# Altium project sonata-board.PrjPcb (part 1 of 4)
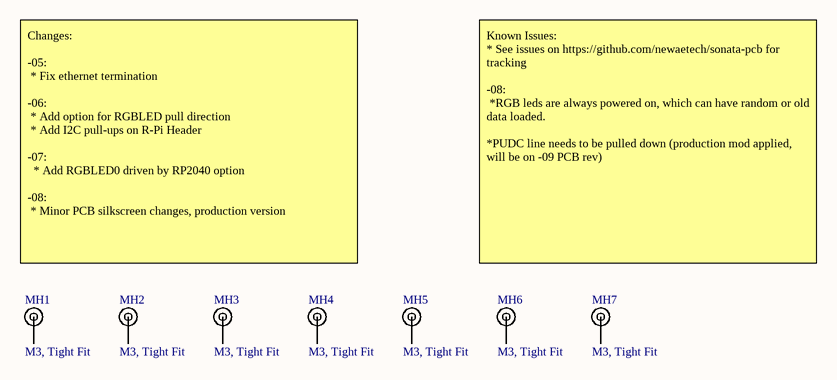
[diagram p0: sb-sonata-mech.SchDoc]
PrjRev: 09; PrjName: Sonata; PrjLicense: CC-SA
20 sheets, 468 parts. Net scope: global (net labels, ports and power ports of the same name join across sheets).
Board file: cheriot-test.PcbDoc
Sheets:
  sb-sonata-mech.SchDoc
  sb-sonata-usb.SchDoc
  sb-sonata-usbhub.SchDoc
  sb-sonata-headers1.SchDoc
  sb-sonata-usbrp.SchDoc
  sb-sonata-industriaal.SchDoc
  sb-sonata-debug.SchDoc
  sb-sonata-led.SchDoc
  sb-sonata-microsd.SchDoc
  sb-sonata-ethmac.SchDoc
  sb-sonata-fpga.SchDoc
  sb-sonata-fpgaio1.SchDoc
  sb-sonata-fpgaio2.SchDoc
  sb-sonata-fpgapwr.SchDoc
  sb-sonata-fpganaalog.SchDoc
  sb-sonata-analoginput.SchDoc
  sb-sonata-psu.SchDoc
  sb-sonata-usbphy.SchDoc
  sb-sonata-hyperram.SchDoc
  sb-sonata-lcd.SchDoc

## Sheet sb-sonata-mech.SchDoc: Mechanical & Title Page
size Letter; Organization: NewAE Technology Inc.; Address1: 1083 Queen St., Suite 196; Address2: Halifax; Address3: NS; Address4: Canada B3H 0B2; SheetNumber: 1; SheetTotal: 20; SheetApproved: YES

### Parts
MH1  M3, Tight Fit  [MOUNT_M3_TIGHT]
MH2  M3, Tight Fit  [MOUNT_M3_TIGHT]
MH3  M3, Tight Fit  [MOUNT_M3_TIGHT]
MH4  M3, Tight Fit  [MOUNT_M3_TIGHT]
MH5  M3, Tight Fit  [MOUNT_M3_TIGHT]
MH6  M3, Tight Fit  [MOUNT_M3_TIGHT]
MH7  M3, Tight Fit  [MOUNT_M3_TIGHT]

### Nets

Not connected (* = marked no-connect by the designer): MH1 1; MH2 1; MH3 1; MH4 1; MH5 1; MH6 1; MH7 1

### Notes on the sheet
- Changes:
  -05:
  * Fix ethernet termination
  -06:
  * Add option for RGBLED pull direction
  * Add I2C pull-ups on R-Pi Header
  -07:
  * Add RGBLED0 driven by RP2040 option
  -08:
  * Minor PCB silkscreen changes, production version
- Known Issues:
  * See issues on https://github.com/newaetech/sonata-pcb for tracking
  -08:
  *RGB leds are always powered on, which can have random or old data loaded.
  *PUDC line needs to be pulled down (production mod applied, will be on -09 PCB rev)
- Title:
- Date:
- Rev:
- Time:
- Project:
- Sheet
- of
- License:
- Copyright © NewAE Technology Inc.
- Approved:
- NewAE.com
- File:

### Library data of the parts
MH1-MH7 = MOUNT_M3_TIGHT: Machine screw M3 Mounting Hole; Component Group: Mechanical; PP Material Stack: 0; Part Number: MOUNT_M3_TIGHT; Pin Count: 1; Component Kind: Mechanical; Component Type: Mechanical; PP Rotation: 0

## Sheet sb-sonata-usb.SchDoc: Debug USB & Power In
size Letter; Organization: NewAE Technology Inc.; Address1: 1083 Queen St., Suite 196; Address2: Halifax; Address3: NS; Address4: Canada B3H 0B2; SheetNumber: 2; SheetTotal: 20; SheetApproved: YES
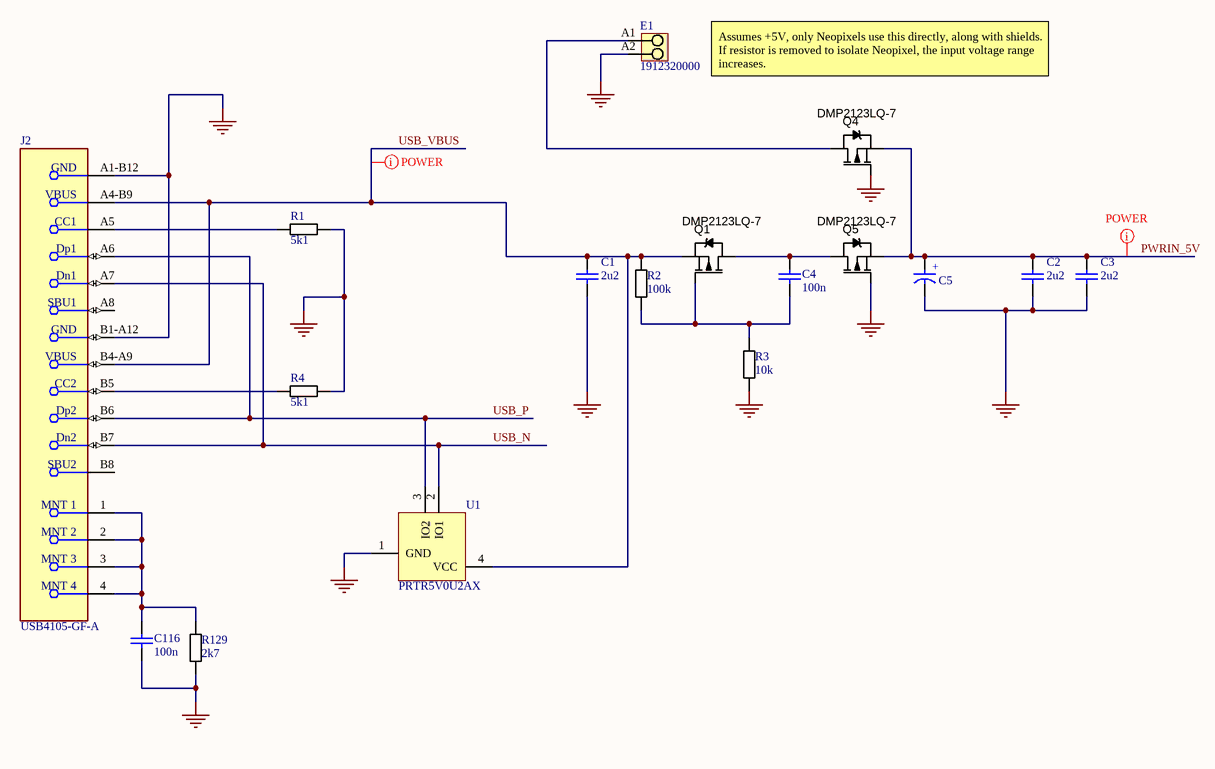
[diagram p1: sb-sonata-usb.SchDoc]

### Parts
C1  2u2  [CAPC0603_M]
C2  2u2  [CAPC0603_M]
C3  2u2  [CAPC0603_M]
C4  100n  [CAPC0402_M]
C5  680uF  [Cap_16v_680uF]  (value not drawn)
C116  100n  [CAPC0402_M]
E1  1912320000  [PS_3_5_90_02]
J2  USB4105-GF-A  [FP-USB4105-GF-A-MFG]
Q1  DMP2123LQ-7  [SOT95P245X110-3M]
Q4  DMP2123LQ-7  [SOT95P245X110-3M]
Q5  DMP2123LQ-7  [SOT95P245X110-3M]
R1  5k1  [RESC1608X55N]
R2  100k  [RESC1005X40N]
R3  10k  [RESC1005X40N]
R4  5k1  [RESC1608X55N]
R129  2k7  [RESC1005X40N]
U1  PRTR5V0U2AX  [SOT143B]

### Nets
GND: C1.2 C2.2 C3.2 C5.2 C116.2 E1.A2 J2.A1-B12(GND) J2.B1-A12(GND) Q4.1(G) Q5.1(G) R1.2 R3.2 R4.2 R129.2 U1.1(GND)
PWRIN_5V: C2.1 C3.1 C5.1 Q4.2(S) Q5.2(S)
USB_N: J2.A7(Dn1) J2.B7(Dn2) U1.2(IO1)
USB_P: J2.A6(Dp1) J2.B6(Dp2) U1.3(IO2)
USB_VBUS: C1.1 J2.A4-B9(VBUS) J2.B4-A9(VBUS) Q1.2(S) R2.1 U1.4(VCC)
NetC4_1: C4.1 Q1.3(D) Q5.3(D)
NetC4_2: C4.2 Q1.1(G) R2.2 R3.1
NetC116_1: C116.1 J2.1(MNT_1) J2.2(MNT_2) J2.3(MNT_3) J2.4(MNT_4) R129.1
NetE1_A1: E1.A1 Q4.3(D)
NetJ2_A5: J2.A5(CC1) R1.1
NetJ2_B5: J2.B5(CC2) R4.1

Not connected (* = marked no-connect by the designer): J2 A8(SBU1) B8(SBU2)

### Layout directives
net class Power: PWRIN_5V, USB_VBUS

### Notes on the sheet
- Assumes +5V, only Neopixels use this directly, along with shields. If resistor is removed to isolate Neopixel, the input voltage range increases.
- Title:
- Date:
- Rev:
- Time:
- Project:
- Sheet
- of
- License:
- Copyright © NewAE Technology Inc.
- Approved:
- NewAE.com
- File:
- (in symbol Cap_16v_680uF) +

### Library data of the parts
C1-C3 = CCHIP-2u2-0603: 2u2, 0603; Manufacture 1: Samsung; Manufacture Part Number 1: CL10B225KP8NNNC; Component Group: Capacitor; Case-EIA: 0603; Case-Metric: 1608; Rated Voltage: 10VDC; Part Number: CCHIP-2u2-0603; Footprint: 0603; Pin Count: 2; Supplier 1: Digi-Key; Supplier Part Number 1: 1276-1134-2-ND; Value: 2u2; Mounting Technology: SMT; Component Kind: Standard; Component Type: Standard
C4 C116 = CCHIP-100n-0402: 100n, 0402; Manufacture Part Number 1: CGA2B3X7R1V104K050BB; Component Group: Capacitor; Case-EIA: 0402; Part Number: CCHIP-100n-0402; Footprint: 0402; Pin Count: 2; Supplier 1: Digi-Key; Supplier Part Number 1: 445-6901-1-ND; Value: 100n; Mounting Technology: SMT; Component Kind: Standard; Component Type: Standard
C5 = Cap_16v_680uF: Aluminum electrolytic 680uF, 8x16mm, radial; Component Group: Capacitor; PP Material Stack: 0; Part Number: Cap_16v_680uF; Pin Count: 2; Value: 680uF; Mounting Technology: Through-hole; Component Kind: Standard; Component Type: Standard; PP Rotation: 0
E1 = CMP-1559-01633-1: OMNIMATE Signal - series PS; Manufacturer: Weidmueller; Mounting_onto_the_PCB: Solder connection; Rated_voltage_for_surge_voltage_class_pollution_degree_II_2: 320 V; UL_94_flammability_rating: V-0; Wire_cross_section_AWG_max_UL_1059: AWG 16; Solid_max_H05_07_V_U: 1,5 mm²; Contact_surface: tinned; Solder_pin_length_mm: 3,5 mm; Solid_min_H05_07_V_U: 0,2 mm²; Side_termination_characteristic: closed side; Rated_current_use_group_B_UL_1059: 10 A; Short_text_for_material: PS 3.50/02/90 3.5SN OR BX; Rated_voltage_use_group_B_UL_1059: 300 V; Pitch_inch: 0,138 inch; Wire_cross_section_AWG_min_UL_1059: AWG 28; Contact_material: Cu-Leg; No_of_poles: 2; Insulating_material: Wemid (PA); Colour: Orange; ComponentLink2Description: URL Link1; PackageReference: PS_3_5_90_02; ComponentLink1URL: http://www.weidmueller.com/; PartNumber: 1912320000; ComponentLink2URL: http://catalog.weidmueller.com/catalog/Start.do?localeId=en&ObjectID=1912320000; Revision: V1; Pitch_mm: 3,5 mm; Qty: 100 PCS; ComponentLink1Description: Manufacturer URL; Packaging: Box
J2 = CMP-245163-000001-1: CONN RCPT USB2.0 TYPEC 5A; Manufacturer: GCT; Voltage Rating: 20V; Is Female: yes; Current Rating: 5/6.25/1.25/0.25A; Number Of Contacts: 16; Conn Orientation: Right Angle; Device Class L1: Connectors; Category: Conn; Lead Free: Yes; RoHS: TRUE; Temperature Range High: +85°C; Digikey Description: CONN RCPT USB2.0 TYPEC 5A; Device Class L3: unset; ComponentLink2Description: Datasheet; Manufacturer Part Number: USB4105-GF-A; Package: 0; Usb Standard: USB 2.0; Device Class L2: USB Connectors; Automotive: No; Temperature Range Low: -40°C; Height: 3.46mm; Temperature: -40°C to +85°C; Contact Material: Gold,Nickel; ComponentLink2URL: https://gct.co/files/drawings/usb4105.pdf; Octopart: https://octopart.com/usb4105-gf-a-gct-106627878
Q1 Q4 Q5 = DMP2123LQ-7: P-Channel, 3A, Logic Level; Manufacture 1: Diodes Inc.; Component Group: MOSFET; Part Number: DMP2123LQ-7; Footprint: SOT23; Manufacture Part Number 1: DMP2123LQ-7; Pin Count: 3; Supplier 1: Digi-Key; Supplier Part Number 1: DMP2123LQ-7DICT-ND; Mounting Technology: SMT; Component Kind: Standard; Component Type: Standard
R1 R4 = RCHIP-5K1-0603: 5k1 res, 0603, 1%, 1/10W; Manufacture 1: Yageo; Manufacture Part Number 1: RC0603FR-075K1L; Component Group: Resistor; Case-EIA: 0603; Case-Metric: 1608; Rated Power: 0.1W; Rated Voltage: 75VDC; Part Number: RCHIP-5K1-0603; Footprint: 0603; Pin Count: 2; Supplier 1: Digi-Key; Supplier Part Number 1: 311-5.10KHRCT-ND; Value: 5k1; Tolerance: 1%; Mounting Technology: SMT; Temperature Range: -55C to 155C; Component Kind: Standard; Component Type: Standard
R2 = RCHIP-100K-0402: 100k res, 0402, 1%, 1/16W; Manufacture 1: Yageo; Manufacture Part Number 1: RC0402FR-07100KL; Component Group: Resistor; Case-EIA: 0402; Case-Metric: 1005; Rated Power: 0.063W; Rated Voltage: 75VDC; Part Number: RCHIP-100K-0402; Footprint: 0402; Pin Count: 2; Supplier 1: Digi-Key; Supplier Part Number 1: 311-100KLRCT-ND; Value: 100k; Tolerance: 1%; Mounting Technology: SMT; Temperature Range: -55C to 155C; Component Kind: Standard; Component Type: Standard
R3 = RCHIP-10K-0402: 10k res, 0402, 1%, 1/16W; Manufacture 1: Yageo; Manufacture Part Number 1: RC0402FR-0710KL; Component Group: Resistor; Case-EIA: 0402; Case-Metric: 1005; Rated Power: 0.063W; Rated Voltage: 75VDC; Part Number: RCHIP-10K-0402; Footprint: 0402; Pin Count: 2; Supplier 1: Digi-Key; Supplier Part Number 1: 311-10.0KLRCT-ND; Value: 10k; Tolerance: 1%; Mounting Technology: SMT; Temperature Range: -55C to 155C; Component Kind: Standard; Component Type: Standard
R129 = RCHIP-2K7-0402: 2k7 res, 0402, 1%, 1/16W; Manufacture 1: Yageo; Manufacture Part Number 1: RC0402FR-072K7L; Component Group: Resistor; Case-EIA: 0402; Case-Metric: 1005; Rated Power: 0.063W; Rated Voltage: 75VDC; Part Number: RCHIP-2K7-0402; Footprint: 0402; Pin Count: 2; Supplier 1: Digi-Key; Supplier Part Number 1: 311-2.70KLRCT-ND; Value: 2k7; Tolerance: 1%; Mounting Technology: SMT; Temperature Range: -55C to 155C; Component Kind: Standard; Component Type: Standard
U1 = PRTR5V0U2AX: USB 2.0 high-speed ESD; Component Group: Diode; Supplier 1: Digi-Key; Supplier Part Number 1: 568-7445-1-ND; Part Number: PRTR5V0U2AX; Pin Count: 4; Component Kind: Standard; Component Type: Standard

## Sheet sb-sonata-usbhub.SchDoc: USB Hub
size Letter; Organization: NewAE Technology Inc.; Address1: 1083 Queen St., Suite 196; Address2: Halifax; Address3: NS; Address4: Canada B3H 0B2; SheetNumber: 3; SheetTotal: 20; SheetApproved: YES
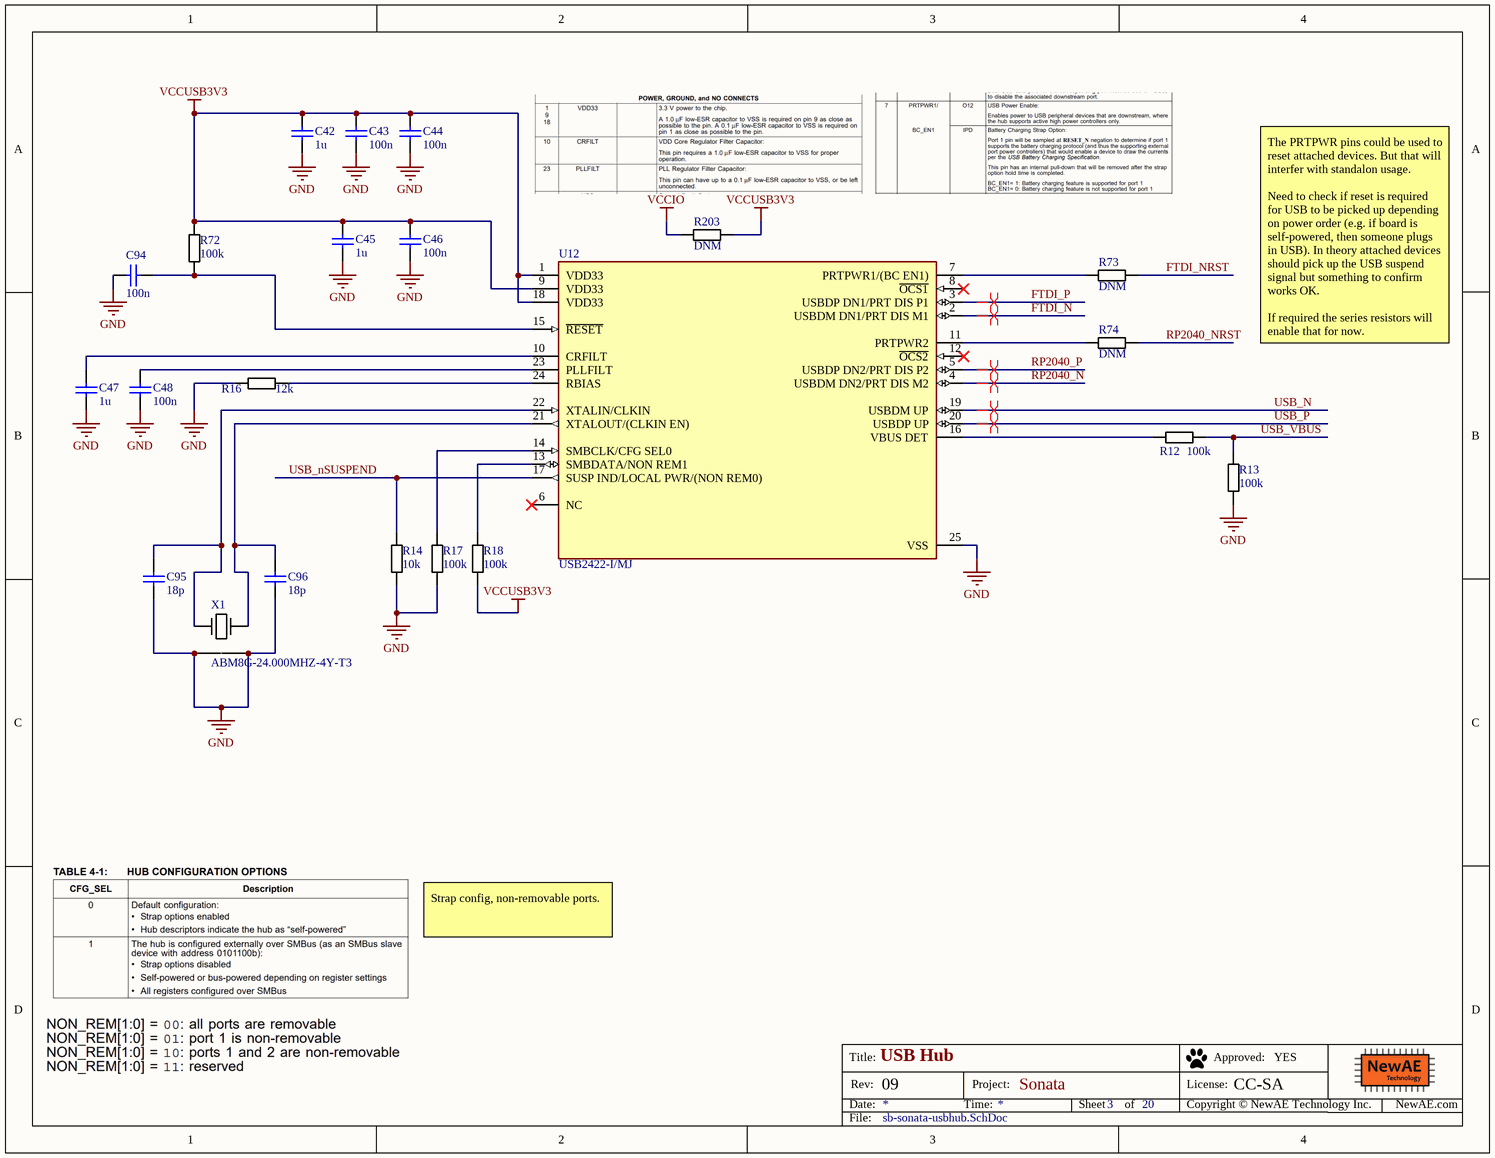
[diagram p2: sb-sonata-usbhub.SchDoc]

### Parts
C42  1u  [CAPC0603_M]
C43  100n  [CAPC0402_M]
C44  100n  [CAPC0402_M]
C45  1u  [CAPC0603_M]
C46  100n  [CAPC0402_M]
C47  1u  [CAPC0603_M]
C48  100n  [CAPC0402_M]
C94  100n  [CAPC0402_M]
C95  18p  [CAPC0402_M]
C96  18p  [CAPC0402_M]
R12  100k  [RESC1005X40N]
R13  100k  [RESC1005X40N]
R14  10k  [RESC1005X40N]
R16  12k  [RESC1005X40N]
R17  100k  [RESC1608X55N]
R18  100k  [RESC1608X55N]
R72  100k  [RESC1608X55N]
R73  DNM  [RESC1005X40N]
R74  DNM  [RESC1005X40N]
R203  DNM  [RESC1005X40N]
U12  USB2422-I/MJ  [FP-24-S4QFN-4x4B-0_5P-MFG]
X1  ABM8G-24.000MHZ-4Y-T3  [ABM8G]

### Nets
GND: C42.2 C43.2 C44.2 C45.2 C46.2 C47.2 C48.2 C94.2 C95.2 C96.2 R13.2 R14.2 R16.2 R17.1 U12.25(VSS) X1.2(GND) X1.4(GND)
VCCIO: R203.1  [project net 3V3_FTDI]
VCCUSB3V3: C42.1 C43.1 C44.1 C45.1 C46.1 R18.1 R72.2 R203.2 U12.1(VDD33) U12.9(VDD33) U12.18(VDD33)
FTDI_N: U12.2(USBDM_DN1/PRT_DIS_M1)
FTDI_NRST: R73.2
FTDI_P: U12.3(USBDP_DN1/PRT_DIS_P1)
RP2040_N: U12.4(USBDM_DN2/PRT_DIS_M2)
RP2040_NRST: R74.2
RP2040_P: U12.5(USBDP_DN2/PRT_DIS_P2)
USB_N: U12.19(USBDM_UP)
USB_nSUSPEND: R14.1 U12.17(SUSP_IND/LOCAL_PWR/(NON_REM0))
USB_P: U12.20(USBDP_UP)
USB_VBUS: R12.2 R13.1
NetC47_1: C47.1 U12.10(CRFILT)
NetC48_1: C48.1 U12.23(PLLFILT)
NetC94_1: C94.1 R72.1 U12.15(~{RESET})
NetC95_1: C95.1 U12.22(XTALIN/CLKIN) X1.3(OUT)
NetC96_1: C96.1 U12.21(XTALOUT/(CLKIN_EN)) X1.1(IN)
NetR12_1: R12.1 U12.16(VBUS_DET)
NetR16_1: R16.1 U12.24(RBIAS)
NetR17_2: R17.2 U12.14(SMBCLK/CFG_SEL0)
NetR18_2: R18.2 U12.13(SMBDATA/NON_REM1)
NetR73_1: R73.1 U12.7(PRTPWR1/(BC_EN1))
NetR74_1: R74.1 U12.11(PRTPWR2)

Not connected (* = marked no-connect by the designer): U12 6(NC)* 8(~{OCS1})* 12(~{OCS2})*

### Layout directives
differential pair; differential pair class USB_DIFF_PAIR: FTDI_N, FTDI_P, RP2040_N, RP2040_P, USB_N, USB_P

### Notes on the sheet
- The PRTPWR pins could be used to reset attached devices. But that will interfer with standalon usage.
  Need to check if reset is required for USB to be picked up depending on power order (e.g. if board is self-powered, then someone plugs in USB). In theory attached devices should pick up the USB suspend signal but something to confirm works OK.
  If required the series resistors will enable that for now.
- Strap config, non-removable ports.
- Title:
- Date:
- Rev:
- Time:
- Project:
- Sheet
- of
- License:
- Copyright © NewAE Technology Inc.
- Approved:
- NewAE.com
- File:

### Library data of the parts
C42 C45 C47 = CCHIP-1u-0603: 1u, 0603, 50V; Manufacture Part Number 1: CL10A105KB8NNNC; Component Group: Capacitor; Case-EIA: 0603; Case-Metric: 1608; Rated Voltage: 50VDC; Part Number: CCHIP-1u-0603; Footprint: 0603; Pin Count: 2; Supplier 1: Digi-Key; Supplier Part Number 1: 1276-1860-1-ND; Value: 1u; Mounting Technology: SMT; Component Kind: Standard; Component Type: Standard
C43 C44 C46 C48 C94 = CCHIP-100n-0402: as C4 on sheet sb-sonata-usb; Part Number: CCHIP-100n-0402; Footprint: 0402; Pin Count: 2; Supplier 1: Digi-Key; Supplier Part Number 1: 445-6901-1-ND; Value: 100n; Mounting Technology: SMT; Component Kind: Standard; Component Type: Standard
C95 C96 = CCHIP-18p-0402: 18p, 0402; Manufacture Part Number 1: GRM1555C1H180JA01D; Component Group: Capacitor; Case-EIA: 0402; Part Number: CCHIP-18p-0402; Footprint: 0402; Pin Count: 2; Supplier 1: Digi-Key; Supplier Part Number 1: 490-5858-1-ND; Value: 18p; Mounting Technology: SMT; Component Kind: Standard; Component Type: Standard
R12 R13 = RCHIP-100K-0402: as R2 on sheet sb-sonata-usb; Part Number: RCHIP-100K-0402; Footprint: 0402; Pin Count: 2; Supplier 1: Digi-Key; Supplier Part Number 1: 311-100KLRCT-ND; Value: 100k; Tolerance: 1%; Mounting Technology: SMT; Temperature Range: -55C to 155C; Component Kind: Standard; Component Type: Standard
R14 = RCHIP-10K-0402: as R3 on sheet sb-sonata-usb; Part Number: RCHIP-10K-0402; Footprint: 0402; Pin Count: 2; Supplier 1: Digi-Key; Supplier Part Number 1: 311-10.0KLRCT-ND; Value: 10k; Tolerance: 1%; Mounting Technology: SMT; Temperature Range: -55C to 155C; Component Kind: Standard; Component Type: Standard
R16 = RCHIP-12K-0402: 12k res, 0402, 1%, 1/16W; Manufacture 1: Yageo; Manufacture Part Number 1: RC0402FR-0712KL; Component Group: Resistor; Case-EIA: 0402; Case-Metric: 1005; Rated Power: 0.063W; Rated Voltage: 75VDC; Part Number: RCHIP-12K-0402; Footprint: 0402; Pin Count: 2; Supplier 1: Digi-Key; Supplier Part Number 1: 311-12.0KLRCT-ND; Value: 12k; Tolerance: 1%; Mounting Technology: SMT; Temperature Range: -55C to 155C; Component Kind: Standard; Component Type: Standard
R17 R18 R72 = RCHIP-100K-0603: 100k res, 0603, 1%, 1/10W; Manufacture 1: Yageo; Manufacture Part Number 1: RC0603FR-07100KL; Component Group: Resistor; Case-EIA: 0603; Case-Metric: 1608; Rated Power: 0.1W; Rated Voltage: 75VDC; Part Number: RCHIP-100K-0603; Footprint: 0603; Pin Count: 2; Supplier 1: Digi-Key; Supplier Part Number 1: 311-100KHRCT-ND; Value: 100k; Tolerance: 1%; Mounting Technology: SMT; Temperature Range: -55C to 155C; Component Kind: Standard; Component Type: Standard
R73 R74 R203 = RCHIP-DNM-0402: Component Group: Resistor; Case-EIA: 0402; Case-Metric: 1005; Part Number: RCHIP-DNM-0402; Footprint: 0402; Pin Count: 2; Value: DNM; Component Kind: Standard; Component Type: Standard
U12 = CMP-06284-000010-1: IC HUB CTLR USB 2.0 24QFN; Manufacturer: Microchip; Min Supply Voltage: 3V; Standoff Height: 0mm; Usb Standard: USB 2.0; Interface: I2C,USB,SMBus; Number Of Ports: 2; Max Supply Voltage: 3.6V; Nominal Supply Current: 29-70mA; Device Class L1: Integrated Circuits (ICs); ComponentLink2URL: http://ww1.microchip.com/downloads/en/DeviceDoc/00001726B.pdf; Temperature: -40°C to +85°C; Lead Free: Yes; Category: IC; RoHS: TRUE; Digikey Description: IC HUB CTLR USB 2.0 24QFN; Device Class L2: Interface ICs; Height: 1mm; Device Class L3: USB Interface ICs; Temperature Range High: +85°C; Automotive: No; Ipc Land Pattern Name: QFN50P400X400X90-24; Temperature Range Low: -40°C; Manufacturer Part Number: USB2422-I/MJ; Mouser Description: Microchip USB2422-I/MJ; USB Controller; USB 2.0; 3 - 3.6 V; 24-Pin SQFN; Package: 24-S4QFN-4x4B-0.5P; Ambient Temperature Range Low: -40°C; ComponentLink2Description: Datasheet; Ambient Temperature Range High: +85°C; Octopart: https://octopart.com/usb2422-i%2Fmj-microchip-29030614
X1 = ABM8G-24.000MHZ-4Y-T3: CRYSTAL 24.0000MHZ 10PF SMD; Manufacture 1: Abracon LLC; Part Number: ABM8G-24.000MHZ-4Y-T3; Component Group: Crystal; Manufacture Part Number 1: ABM8G-24.000MHZ-4Y-T3; Pin Count: 4; Supplier 1: Digi-Key; Supplier Part Number 1: 535-10913-1-ND; Value: 24.000MHz; Component Kind: Standard; Component Type: Standard

## Sheet sb-sonata-headers1.SchDoc: Header Pins
size Letter; Organization: NewAE Technology Inc.; Address1: 1083 Queen St., Suite 196; Address2: Halifax; Address3: NS; Address4: Canada B3H 0B2; SheetNumber: 4; SheetTotal: 20; SheetApproved: YES
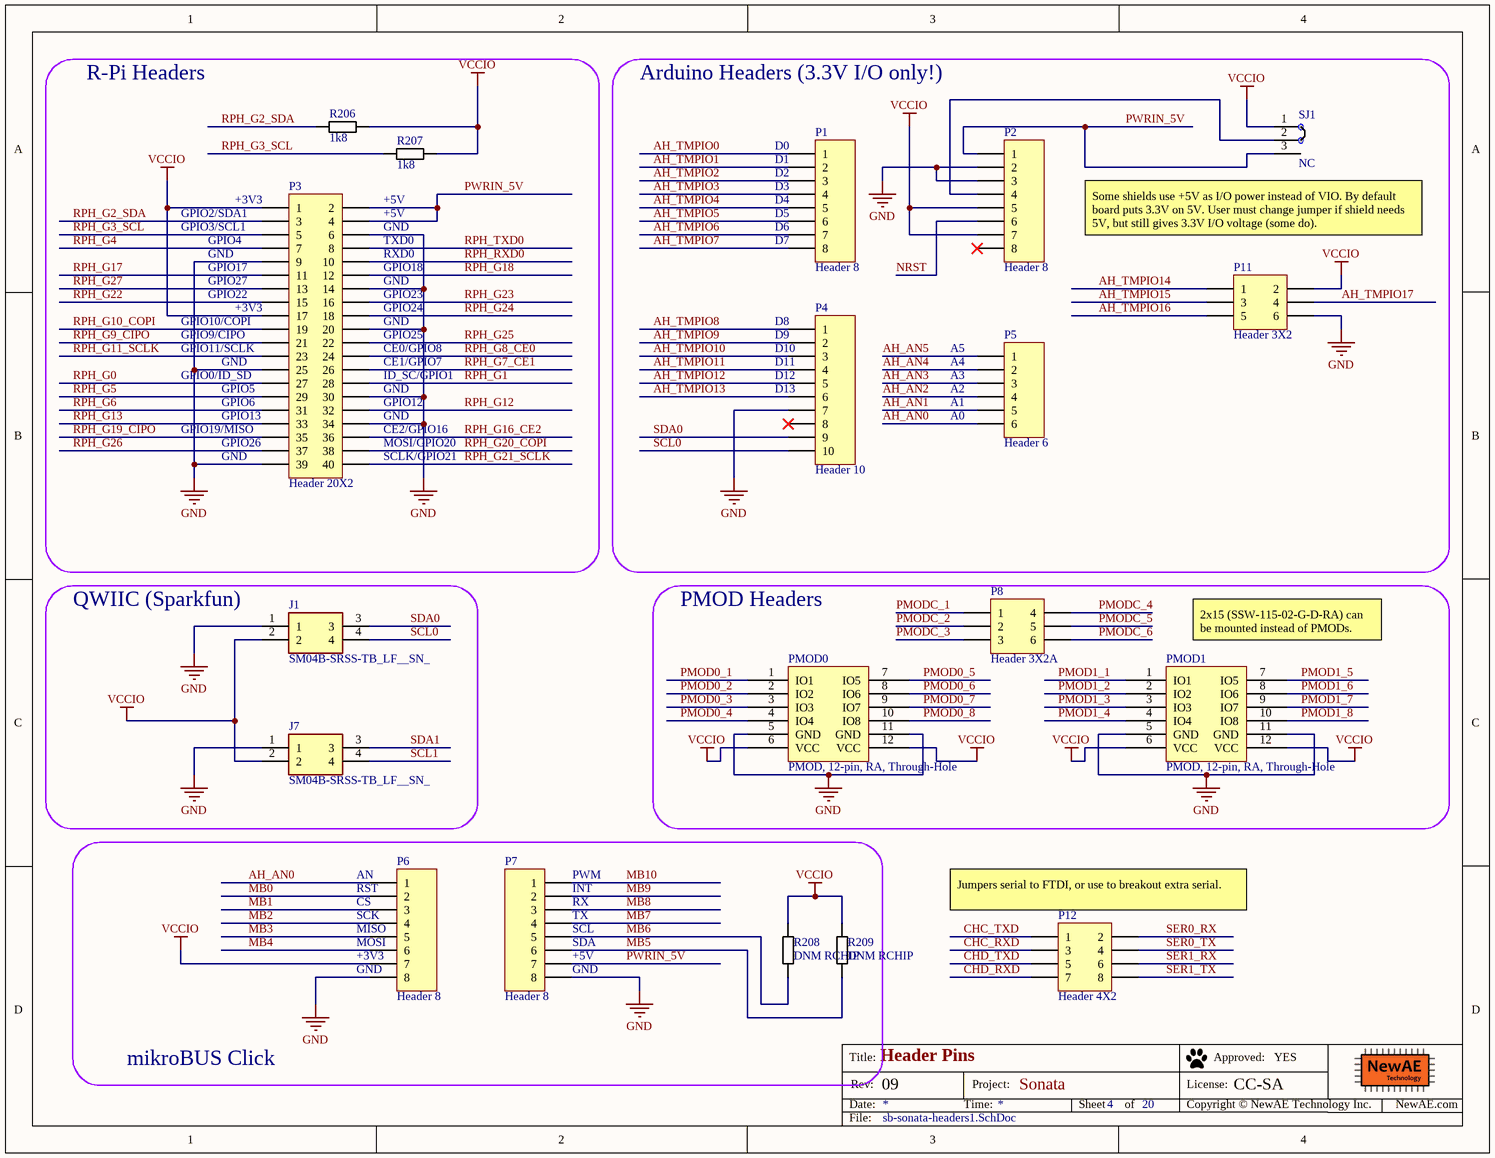
[diagram p3: sb-sonata-headers1.SchDoc]

### Parts
J1  SM04B-SRSS-TB_LF__SN_  [SM04B-SRSS-TB(LFSN)]
J7  SM04B-SRSS-TB_LF__SN_  [SM04B-SRSS-TB(LFSN)]
P1  Header 8  [HDR1X8_SLW-108-01-T-S]
P2  Header 8  [HDR1X8_SLW-108-01-T-S]
P3  Header 20X2  [HDR2X20_861400402YO2LF]
P4  Header 10  [HDR1X10_SLW-110-01-T-S]
P5  Header 6  [HDR1X6_SLW-106-01-T-S]
P6  Header 8  [HDR1X8_SLW-108-01-T-S]
P7  Header 8  [HDR1X8_SLW-108-01-T-S]
P8  Header 3X2A  [HDR2X3_CEN]
P11  Header 3X2  [HDR2X3_XG8T-0641]
P12  Header 4X2  [HDR2X4_XG8T-0841]
PMOD0  PMOD, 12-pin, RA, Through-Hole  [SAMTEC_SSW_106_02_X_D_RA_PMOD]
PMOD1  PMOD, 12-pin, RA, Through-Hole  [SAMTEC_SSW_106_02_X_D_RA_PMOD]
R206  1k8  [RESC1608X55N]
R207  1k8  [RESC1608X55N]
R208  DNM RCHIP  [RESC1608X55N]
R209  DNM RCHIP  [RESC1608X55N]
SJ1  NC  [SJ_3S_NC12]  (no BOM)

### Blocks framed on the sheet
R-Pi Headers: P3 R206 R207
Arduino Headers (3.3V I/O only!): P1 P2 P4 P5 P11 SJ1
QWIIC (Sparkfun): J1 J7
PMOD Headers: P8 PMOD0 PMOD1
mikroBUS Click: P6 P7 R208 R209

### Nets
GND: J1.1 J7.1 P2.2 P2.3 P3.6 P3.9 P3.14 P3.20 P3.25 P3.30 P3.34 P3.39 P4.7 P6.8 P7.8 P11.6 PMOD0.5(GND) PMOD0.11(GND) PMOD1.5(GND) PMOD1.11(GND)
VCCIO: J1.2 J7.2 P2.5 P2.7 P3.1 P3.17 P6.7 P11.2 PMOD0.6(VCC) PMOD0.12(VCC) PMOD1.6(VCC) PMOD1.12(VCC) R206.2 R207.2 R208.1 R209.1 SJ1.1  [project net 3V3_FTDI]
AH_AN0: P5.6 P6.1
AH_AN1: P5.5
AH_AN2: P5.4
AH_AN3: P5.3
AH_AN4: P5.2
AH_AN5: P5.1
AH_TMPIO0: P1.1
AH_TMPIO1: P1.2
AH_TMPIO2: P1.3
AH_TMPIO3: P1.4
AH_TMPIO4: P1.5
AH_TMPIO5: P1.6
AH_TMPIO6: P1.7
AH_TMPIO7: P1.8
AH_TMPIO8: P4.1
AH_TMPIO9: P4.2
AH_TMPIO10: P4.3
AH_TMPIO11: P4.4
AH_TMPIO12: P4.5
AH_TMPIO13: P4.6
AH_TMPIO14: P11.1
AH_TMPIO15: P11.3
AH_TMPIO16: P11.5
AH_TMPIO17: P11.4
CHC_RXD: P12.3
CHC_TXD: P12.1
CHD_RXD: P12.7
CHD_TXD: P12.5
MB0: P6.2
MB1: P6.3
MB2: P6.4
MB3: P6.5
MB4: P6.6
MB5: P7.6 R209.2
MB6: P7.5 R208.2
MB7: P7.4
MB8: P7.3
MB9: P7.2
MB10: P7.1
NRST: P2.6
PMOD0_1: PMOD0.1(IO1)
PMOD0_2: PMOD0.2(IO2)
PMOD0_3: PMOD0.3(IO3)
PMOD0_4: PMOD0.4(IO4)
PMOD0_5: PMOD0.7(IO5)
PMOD0_6: PMOD0.8(IO6)
PMOD0_7: PMOD0.9(IO7)
PMOD0_8: PMOD0.10(IO8)
PMOD1_1: PMOD1.1(IO1)
PMOD1_2: PMOD1.2(IO2)
PMOD1_3: PMOD1.3(IO3)
PMOD1_4: PMOD1.4(IO4)
PMOD1_5: PMOD1.7(IO5)
PMOD1_6: PMOD1.8(IO6)
PMOD1_7: PMOD1.9(IO7)
PMOD1_8: PMOD1.10(IO8)
PMODC_1: P8.1
PMODC_2: P8.2
PMODC_3: P8.3
PMODC_4: P8.4
PMODC_5: P8.5
PMODC_6: P8.6
PWRIN_5V: P2.1 P3.2 P3.4 P7.7 SJ1.3
RPH_G0: P3.27
RPH_G1: P3.28
RPH_G2_SDA: P3.3 R206.1
RPH_G3_SCL: P3.5 R207.1
RPH_G4: P3.7
RPH_G5: P3.29
RPH_G6: P3.31
RPH_G7_CE1: P3.26
RPH_G8_CE0: P3.24
RPH_G9_CIPO: P3.21
RPH_G10_COPI: P3.19
RPH_G11_SCLK: P3.23
RPH_G12: P3.32
RPH_G13: P3.33
RPH_G16_CE2: P3.36
RPH_G17: P3.11
RPH_G18: P3.12
RPH_G19_CIPO: P3.35
RPH_G20_COPI: P3.38
RPH_G21_SCLK: P3.40
RPH_G22: P3.15
RPH_G23: P3.16
RPH_G24: P3.18
RPH_G25: P3.22
RPH_G26: P3.37
RPH_G27: P3.13
RPH_RXD0: P3.10
RPH_TXD0: P3.8
SCL0: J1.4 P4.10
SCL1: J7.4
SDA0: J1.3 P4.9
SDA1: J7.3
SER0_RX: P12.2
SER0_TX: P12.4
SER1_RX: P12.6
SER1_TX: P12.8
NetP2_4: P2.4 SJ1.2

Not connected (* = marked no-connect by the designer): P2 8*; P4 8*

### Notes on the sheet
- (near P1) D0
- (near P1) D1
- (near P3) GPIO2/SDA1
- (near P3) GPIO3/SCL1
- (near P3) +3V3
- +5V
- (near P3) GND
- (near P1) D2
- (near P1) D3
- (near P1) D4
- (near P1) D5
- (near P1) D6
- (near SJ1) Some shields use +5V as I/O power instead of VIO. By default board puts 3.3V on 5V. User must change jumper if shield needs 5V, but still gives 3.3V I/O voltage (some do).
- (near P3) GPIO4
- GND
- (near P3) GPIO17
- (near P3) GPIO27
- (near P3) GPIO22
- (near P3) TXD0
- (near P3) RXD0
- (near P3) GPIO18
- (near P3) GPIO23
- (near P1) D7
- (near P3) GPIO10/COPI
- (near P3) GPIO9/CIPO
- (near P3) GPIO11/SCLK
- (near P3) GPIO24
- (near P3) GPIO25
- (near P3) CE0/GPIO8
- (near P3) CE1/GPIO7
- (near P4) D8
- (near P4) D9
- (near P4) D10
- (near P4) D11
- (near P5) A4
- (near P5) A5
- (near P3) GPIO0/ID_SD
- (near P3) GPIO19/MISO
- (near P3) GPIO5
- (near P3) GPIO6
- (near P3) GPIO13
- (near P3) ID_SC/GPIO1
- (near P3) GPIO12
- (near P3) CE2/GPIO16
- (near P4) D12
- (near P4) D13
- (near P5) A0
- (near P5) A1
- (near P5) A2
- (near P5) A3
- (near P3) GPIO26
- (near P3) MOSI/GPIO20
- (near P3) SCLK/GPIO21
- (near PMOD1) 2x15 (SSW-115-02-G-D-RA) can be mounted instead of PMODs.
- (near P6) AN
- (near P6) RST
- (near P6) CS
- (near P7) RX
- (near P7) INT
- (near P7) PWM
- (near P12) Jumpers serial to FTDI, or use to breakout extra serial.
- (near P6) SCK
- (near P6) MISO
- (near P6) MOSI
- (near P6) +3V3
- (near P6) GND
- (near P7) GND
- (near P7) +5V
- (near P7) SDA
- (near P7) SCL
- (near P7) TX
- Title:
- Date:
- Rev:
- Time:
- Project:
- Sheet
- of
- License:
- Copyright © NewAE Technology Inc.
- Approved:
- NewAE.com
- File:

### Library data of the parts
J1 J7 = SM04B-SRSS-TB_LF__SN_: Connector; Manufacturer_Name: JST (JAPAN SOLDERLESS TERMINALS); Manufacturer_Part_Number: SM04B-SRSS-TB(LF)(SN); Datasheet Link: http://www.jst-mfg.com/product/pdf/eng/eSH.pdf; Arrow Part Number: SM04B-SRSS-TB(LF)(SN); Arrow Price/Stock: https://www.arrow.com/en/products/sm04b-srss-tb-lf-sn/jst-manufacturing?region=europe
P1 P2 P6 P7 = Header 8: Header, 8-Pin; LatestRevisionDate: 17-Jul-2002; LatestRevisionNote: Re-released for DXP Platform.; Publisher: Altium Limited
P3 = Header 20X2: Header, 20-Pin, Dual row; LatestRevisionDate: 17-Jul-2002; LatestRevisionNote: Re-released for DXP Platform.; Publisher: Altium Limited
P4 = Header 10: Header, 10-Pin; LatestRevisionDate: 17-Jul-2002; LatestRevisionNote: Re-released for DXP Platform.; Publisher: Altium Limited
P5 = Header 6: Header, 6-Pin; LatestRevisionDate: 17-Jul-2002; LatestRevisionNote: Re-released for DXP Platform.; Publisher: Altium Limited
P8 = Header 3X2A: Header, 3-Pin, Dual row; LatestRevisionDate: 17-Jul-2002; LatestRevisionNote: Re-released for DXP Platform.; Publisher: Altium Limited
P11 = Header 3X2: Header, 3-Pin, Dual row; LatestRevisionDate: 17-Jul-2002; LatestRevisionNote: Re-released for DXP Platform.; Publisher: Altium Limited
P12 = Header 4X2: Header, 4-Pin, Dual row; LatestRevisionDate: 17-Jul-2002; LatestRevisionNote: Re-released for DXP Platform.; Publisher: Altium Limited
PMOD0 PMOD1 = PMOD_2ROW_FEMALERATH: Component Group: Connector; PP Material Stack: 0; Part Number: PMOD_2ROW_FEMALERATH; Pin Count: 12; Supplier 1: Digi-Key; Supplier Part Number 1: SAM1215-06-ND; Component Kind: Standard; Component Type: Standard; PP Rotation: 0; PP Rotation1: 0
R206 R207 = RCHIP-1K8-0603: 1k8 res, 0603, 1%, 1/10W; Manufacture 1: Yageo; Manufacture Part Number 1: RC0603FR-071K8L; Component Group: Resistor; Case-EIA: 0603; Case-Metric: 1608; Rated Power: 0.1W; Rated Voltage: 75VDC; Part Number: RCHIP-1K8-0603; Footprint: 0603; Pin Count: 2; Supplier 1: Digi-Key; Supplier Part Number 1: 311-1.80KHRCT-ND; Value: 1k8; Tolerance: 1%; Mounting Technology: SMT; Temperature Range: -55C to 155C; Component Kind: Standard; Component Type: Standard
R208 R209 = RCHIP-DNM-0603: Do Not Mount Resistor; Case-EIA: 0603; Case-Metric: 1608; Part Number: RCHIP-DNM-0603; Component Group: Resistor; Footprint: 0603; Pin Count: 2; Mounting Technology: SMT; Component Kind: Standard; Component Type: Standard
SJ1 = SJ_3S_12JMP: Solder Jumper, NC; Component Group: PCB Feature; Part Number: SJ_3S_12JMP; Pin Count: 3; Mounting Technology: COPPER; Component Type: Standard (No BOM)

## Sheet sb-sonata-usbrp.SchDoc: RP2040 Controller
size Letter; Organization: NewAE Technology Inc.; Address1: 1083 Queen St., Suite 196; Address2: Halifax; Address3: NS; Address4: Canada B3H 0B2; SheetNumber: 5; SheetTotal: 20; SheetApproved: NO
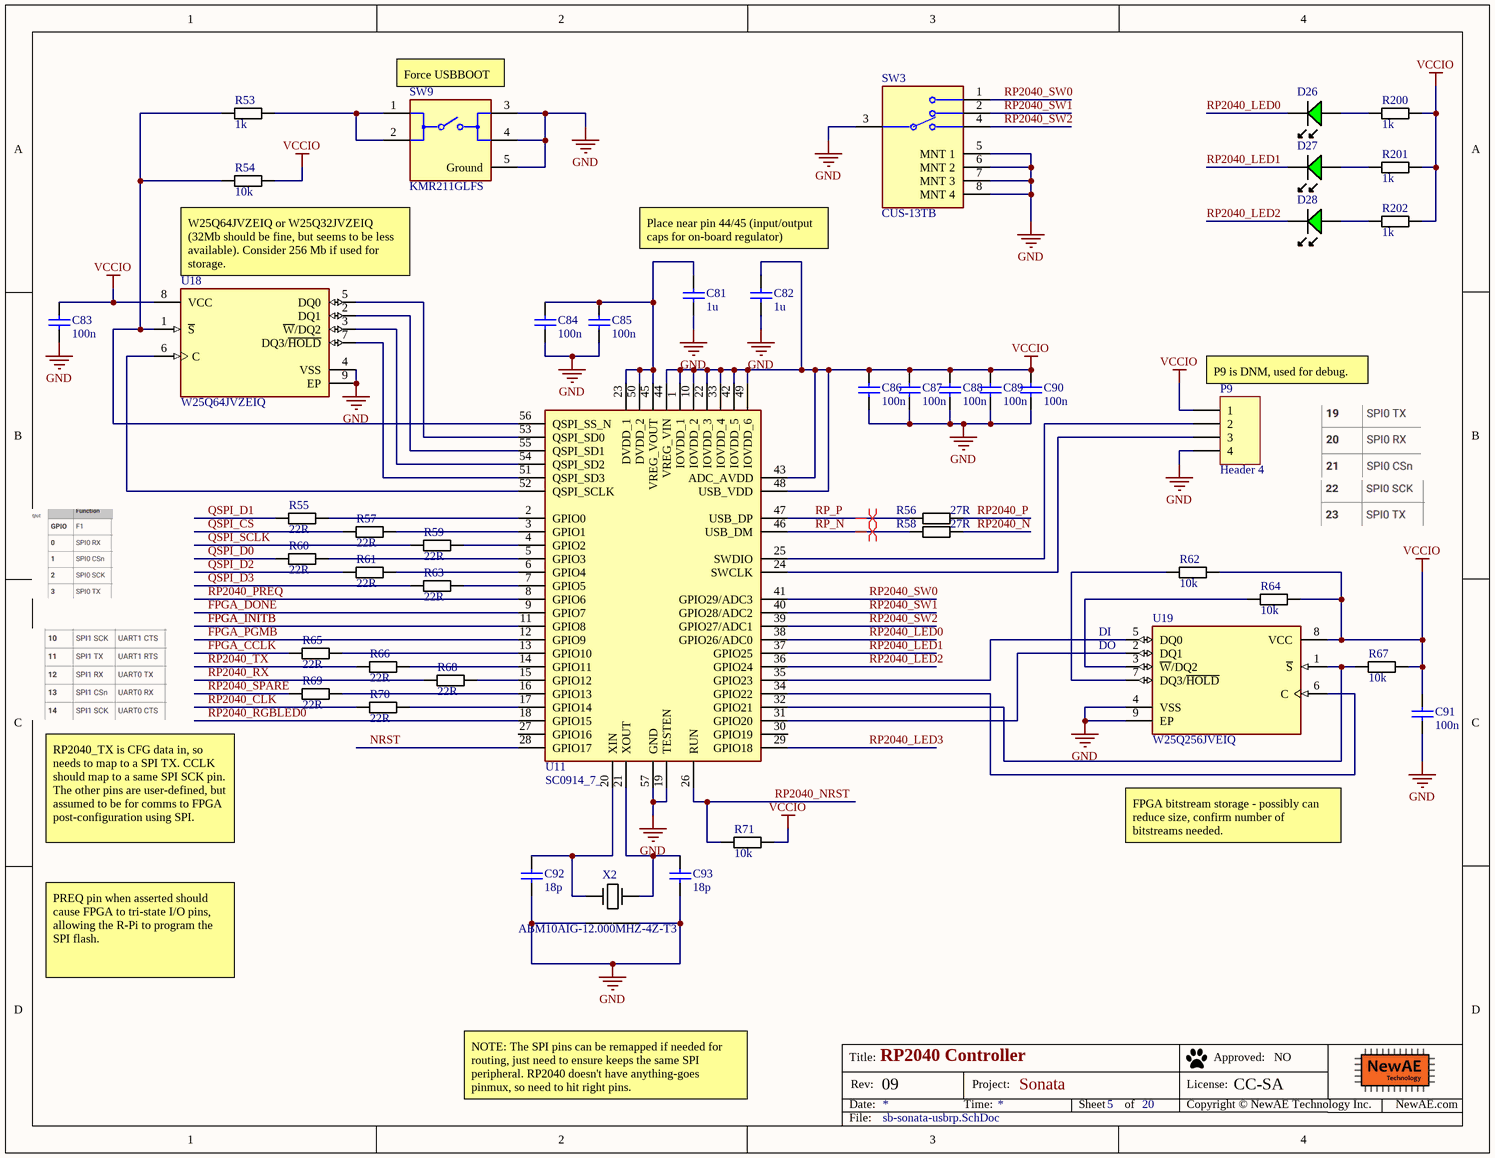
[diagram p4: sb-sonata-usbrp.SchDoc]

### Parts
C81  1u  [CAPC0603_M]
C82  1u  [CAPC0603_M]
C83  100n  [CAPC0402_M]
C84  100n  [CAPC0402_M]
C85  100n  [CAPC0402_M]
C86  100n  [CAPC0402_M]
C87  100n  [CAPC0402_M]
C88  100n  [CAPC0402_M]
C89  100n  [CAPC0402_M]
C90  100n  [CAPC0402_M]
C91  100n  [CAPC0402_M]
C92  18p  [CAPC0402_M]
C93  18p  [CAPC0402_M]
D26  LED, 0603, Green  [LED-0603-GREEN]  (value not drawn)
D27  LED, 0603, Green  [LED-0603-GREEN]  (value not drawn)
D28  LED, 0603, Green  [LED-0603-GREEN]  (value not drawn)
P9  Header 4  [HDR1X4]
R53  1k  [RESC1005X40N]
R54  10k  [RESC1005X40N]
R55  22R  [RESC1005X40N]
R56  27R  [RESC1005X40N]
R57  22R  [RESC1005X40N]
R58  27R  [RESC1005X40N]
R59  22R  [RESC1005X40N]
R60  22R  [RESC1005X40N]
R61  22R  [RESC1005X40N]
R62  10k  [RESC1005X40N]
R63  22R  [RESC1005X40N]
R64  10k  [RESC1005X40N]
R65  22R  [RESC1005X40N]
R66  22R  [RESC1005X40N]
R67  10k  [RESC1005X40N]
R68  22R  [RESC1005X40N]
R69  22R  [RESC1005X40N]
R70  22R  [RESC1005X40N]
R71  10k  [RESC1005X40N]
R200  1k  [RESC1005X40N]
R201  1k  [RESC1005X40N]
R202  1k  [RESC1005X40N]
SW3  CUS-13TB  [FP-CUS-13TB-MFG]
SW9  KMR211GLFS  [FP-KMR211GLFS-MFG]
U11  SC0914_7_  [QFN40P700X700X90-57N-D]
U18  W25Q64JVZEIQ  [WSON68_Micron]
U19  W25Q256JVEIQ  [WSON68_Micron]
X2  ABM10AIG-12.000MHZ-4Z-T3  [2.5x2mm XTAL]

### Nets
GND: C81.2 C82.2 C83.2 C84.2 C85.2 C86.2 C87.2 C88.2 C89.2 C90.2 C91.2 C92.2 C93.2 P9.4 SW3.3(C) SW3.5(MNT_1) SW3.6(MNT_2) SW3.7(MNT_3) SW3.8(MNT_4) SW9.3 SW9.4 SW9.5(Ground) U11.19(TESTEN) U11.57(GND) U18.4(VSS) U18.9(EP) U19.4(VSS) U19.9(EP) X2.2(GND) X2.4(GND)
VCCIO: C82.1 C83.1 C86.1 C87.1 C88.1 C89.1 C90.1 C91.1 P9.1 R54.1 R62.1 R64.1 R67.2 R71.2 R200.2 R201.2 R202.2 U11.1(IOVDD_1) U11.10(IOVDD_2) U11.22(IOVDD_3) U11.33(IOVDD_4) U11.42(IOVDD_5) U11.43(ADC_AVDD) U11.44(VREG_VIN) U11.48(USB_VDD) U11.49(IOVDD_6) U18.8(VCC) U19.8(VCC)  [project net 3V3_FTDI]
FPGA_CCLK: R65.1
FPGA_DONE: U11.9(GPIO7)
FPGA_INITB: U11.11(GPIO8)
FPGA_PGMB: U11.12(GPIO9)
NRST: U11.28(GPIO17)
QSPI_CS: R57.1
QSPI_D0: R60.1
QSPI_D1: R55.1
QSPI_D2: R61.1
QSPI_D3: R63.1
QSPI_SCLK: R59.1
RP2040_CLK: R70.1
RP2040_LED0: D26.K U11.38(GPIO26/ADC0)
RP2040_LED1: D27.K U11.37(GPIO25)
RP2040_LED2: D28.K U11.36(GPIO24)
RP2040_LED3: U11.29(GPIO18)
RP2040_N: R58.1
RP2040_NRST: R71.1 U11.26(RUN)
RP2040_P: R56.1
RP2040_PREQ: U11.8(GPIO6)
RP2040_RGBLED0: U11.18(GPIO15)
RP2040_RX: R68.1
RP2040_SPARE: R69.1
RP2040_SW0: SW3.1 U11.41(GPIO29/ADC3)
RP2040_SW1: SW3.2 U11.40(GPIO28/ADC2)
RP2040_SW2: SW3.4 U11.39(GPIO27/ADC1)
RP2040_TX: R66.1
RP_N: R58.2 U11.46(USB_DM)
RP_P: R56.2 U11.47(USB_DP)
NetC81_1: C81.1 C84.1 C85.1 U11.23(DVDD_1) U11.45(VREG_VOUT) U11.50(DVDD_2)
NetC92_1: C92.1 U11.20(XIN) X2.1(IN)
NetC93_1: C93.1 U11.21(XOUT) X2.3(OUT)
NetD26_A: D26.A R200.1
NetD27_A: D27.A R201.1
NetD28_A: D28.A R202.1
NetP9_2: P9.2 U11.25(SWDIO)
NetP9_3: P9.3 U11.24(SWCLK)
NetR53_1: R53.1 R54.2 U11.56(QSPI_SS_N) U18.1(~{S})
NetR53_2: R53.2 SW9.1 SW9.2
NetR55_2: R55.2 U11.2(GPIO0)
NetR57_2: R57.2 U11.3(GPIO1)
NetR59_2: R59.2 U11.4(GPIO2)
NetR60_2: R60.2 U11.5(GPIO3)
NetR61_2: R61.2 U11.6(GPIO4)
NetR62_2: R62.2 U19.7(DQ3/~{HOLD})
NetR63_2: R63.2 U11.7(GPIO5)
NetR64_2: R64.2 U19.3(~{W}/DQ2)
NetR65_2: R65.2 U11.13(GPIO10)
NetR66_2: R66.2 U11.14(GPIO11)
NetR67_1: R67.1 U11.32(GPIO21) U19.1(~{S})
NetR68_2: R68.2 U11.15(GPIO12)
NetR69_2: R69.2 U11.16(GPIO13)
NetR70_2: R70.2 U11.17(GPIO14)
NetU11_31: U11.31(GPIO20) U19.2(DQ1)
NetU11_34: U11.34(GPIO22) U19.6(C)
NetU11_35: U11.35(GPIO23) U19.5(DQ0)
NetU11_51: U11.51(QSPI_SD3) U18.7(DQ3/~{HOLD})
NetU11_52: U11.52(QSPI_SCLK) U18.6(C)
NetU11_53: U11.53(QSPI_SD0) U18.5(DQ0)
NetU11_54: U11.54(QSPI_SD2) U18.3(~{W}/DQ2)
NetU11_55: U11.55(QSPI_SD1) U18.2(DQ1)

Not connected (* = marked no-connect by the designer): U11 27(GPIO16) 30(GPIO19)

### Layout directives
differential pair; differential pair class USB_DIFF_PAIR: RP_N, RP_P

### Notes on the sheet
- (near SW9) Force USBBOOT
- W25Q64JVZEIQ or W25Q32JVZEIQ (32Mb should be fine, but seems to be less available). Consider 256 Mb if used for storage.
- Place near pin 44/45 (input/output caps for on-board regulator)
- (near P9) P9 is DNM, used for debug.
- (near U19) DI
- (near U19) DO
- RP2040_TX is CFG data in, so needs to map to a SPI TX. CCLK should map to a same SPI SCK pin. The other pins are user-defined, but assumed to be for comms to FPGA post-configuration using SPI.
- FPGA bitstream storage - possibly can reduce size, confirm number of bitstreams needed.
- PREQ pin when asserted should cause FPGA to tri-state I/O pins, allowing the R-Pi to program the SPI flash.
- NOTE: The SPI pins can be remapped if needed for routing, just need to ensure keeps the same SPI peripheral. RP2040 doesn't have anything-goes pinmux, so need to hit right pins.
- Title:
- Date:
- Rev:
- Time:
- Project:
- Sheet
- of
- License:
- Copyright © NewAE Technology Inc.
- Approved:
- NewAE.com
- File:

### Library data of the parts
C81 C82 = CCHIP-1u-0603: as C42 on sheet sb-sonata-usbhub; Part Number: CCHIP-1u-0603; Footprint: 0603; Pin Count: 2; Supplier 1: Digi-Key; Supplier Part Number 1: 1276-1860-1-ND; Value: 1u; Mounting Technology: SMT; Component Kind: Standard; Component Type: Standard
C83-C91 = CCHIP-100n-0402: as C4 on sheet sb-sonata-usb; Part Number: CCHIP-100n-0402; Footprint: 0402; Pin Count: 2; Supplier 1: Digi-Key; Supplier Part Number 1: 445-6901-1-ND; Value: 100n; Mounting Technology: SMT; Component Kind: Standard; Component Type: Standard
C92 C93 = CCHIP-18p-0402: as C95 on sheet sb-sonata-usbhub; Part Number: CCHIP-18p-0402; Footprint: 0402; Pin Count: 2; Supplier 1: Digi-Key; Supplier Part Number 1: 490-5858-1-ND; Value: 18p; Mounting Technology: SMT; Component Kind: Standard; Component Type: Standard
D26-D28 = LEDCHIP_0603_GREEN: Chip LED, Green; Manufacture 1: Kingbright; Manufacture Part Number 1: APT1608CGCK; Component Group: Optical; PP Material Stack: 16; PP Rotation: -90; Part Number: LEDCHIP_0603_GREEN; Pin Count: 2; Supplier 1: Digi-Key; Supplier Part Number 1: 754-1116-1-ND; Mounting Technology: SMT; Component Kind: Standard; Component Type: Standard
P9 = Header 4: Header, 4-Pin; LatestRevisionDate: 17-Jul-2002; LatestRevisionNote: Re-released for DXP Platform.; Publisher: Altium Limited
R53 R200-R202 = RCHIP-1K-0402: 1k res, 0402, 1%, 1/16W; Manufacture 1: Yageo; Manufacture Part Number 1: RC0402FR-071KL; Component Group: Resistor; Case-EIA: 0402; Case-Metric: 1005; Rated Power: 0.063W; Rated Voltage: 75VDC; Part Number: RCHIP-1K-0402; Footprint: 0402; Pin Count: 2; Supplier 1: Digi-Key; Supplier Part Number 1: 311-1.00KLRCT-ND; Value: 1k; Tolerance: 1%; Mounting Technology: SMT; Temperature Range: -55C to 155C; Component Kind: Standard; Component Type: Standard
R54 R62 R64 R67 R71 = RCHIP-10K-0402: as R3 on sheet sb-sonata-usb; Part Number: RCHIP-10K-0402; Footprint: 0402; Pin Count: 2; Supplier 1: Digi-Key; Supplier Part Number 1: 311-10.0KLRCT-ND; Value: 10k; Tolerance: 1%; Mounting Technology: SMT; Temperature Range: -55C to 155C; Component Kind: Standard; Component Type: Standard
R55 R57 R59-R61 R63 R65 R66 R68-R70 = RCHIP-22R-0402: 22R res, 0402, 1%, 1/16W; Manufacture 1: Yageo; Manufacture Part Number 1: RC0402FR-0722RL; Component Group: Resistor; Case-EIA: 0402; Case-Metric: 1005; Rated Power: 0.063W; Rated Voltage: 75VDC; Part Number: RCHIP-22R-0402; Footprint: 0402; Pin Count: 2; Supplier 1: Digi-Key; Supplier Part Number 1: 311-22.0LRCT-ND; Value: 22R; Tolerance: 1%; Mounting Technology: SMT; Temperature Range: -55C to 155C; Component Kind: Standard; Component Type: Standard
R56 R58 = RCHIP-27R-0402: 27R res, 0402, 1%, 1/16W; Manufacture 1: Yageo; Manufacture Part Number 1: RC0402FR-0727RL; Component Group: Resistor; Case-EIA: 0402; Case-Metric: 1005; Rated Power: 0.063W; Rated Voltage: 75VDC; Part Number: RCHIP-27R-0402; Footprint: 0402; Pin Count: 2; Supplier 1: Digi-Key; Supplier Part Number 1: YAG3086CT-ND; Value: 27R; Tolerance: 1%; Mounting Technology: SMT; Temperature Range: -55C to 155C; Component Kind: Standard; Component Type: Standard
SW3 = CMP-71745-000014-1: SWITCH SLIDE SP3T 300MA 4V; Actuator Length: 1.5mm; Electrical Life: 10000Cycles; Max Voltage Rating (DC): 20V; Switch Function: On-On-On; Actuator Material: Nylon; Actuator Type: Standard; Contact Style: Non-Shorting; Contact Plating: Gold; Termination: Gull Wing; Radiation Hardening: No; Series: CUS; Max Operating Temperature: 70°C; Mount: Surface Mount; Switch Travel: 1.5mm; Packaging: Tape and Reel; Min Operating Temperature: -20°C; Contact Material: Copper Alloy; Orientation: Right Angle; Voltage Rating (DC): 4V; RoHS Compliant: Yes; Current Rating: 300mA; Throw Configuration: SP3T
SW9 = CMP-10040-000023-1: SWITCH TACTILE SPST-NO 0.05A 32V; Switch Function: Off-Mom; Throw Configuration: SPST; Switch Travel: 0.2mm; Current Rating: 50mA; Illumination Type: Non-Illuminated; Actuator Length: 0.5mm; Power Rating: 1W; Operating Force: 1.2N; Actuator Type: Standard; Mechanical Life: 200000Cycles; REACH SVHC: No SVHC; Voltage Rating (DC): 32V; Length: 2.8mm; Min Operating Temperature: -40°C; Mount: Surface Mount; Max Voltage Rating (DC): 32V; Width: 2.8mm; Depth: 4.6mm; Packaging: Tape and Reel; Lead Free: Lead Free; Contact Material: Silver; Termination: Gull Wing; Package Quantity: 1; Contact Current Rating: 50mA; Orientation: Straight; Max Operating Temperature: 85°C; Radiation Hardening: No; Max Current Rating: 50mA; Contact Plating: Silver
U11 = SC0914_7_: Connector; Manufacturer_Name: RASPBERRY-PI; Manufacturer_Part_Number: SC0914(7); Datasheet Link: https://www.mouser.com/datasheet/2/635/rp2040_datasheet-3048960.pdf; Height: 0.9mm; Mouser Part Number: 358-SC09147; Mouser Price/Stock: https://www.mouser.co.uk/ProductDetail/Raspberry-Pi/SC09147?qs=T%252BzbugeAwjhSpdbCB4ve%252Bg%3D%3D
U18 = MT25QL256ABA1EW9-0SIT: IC FLASH 64M SPI 133MHZ 8WPDFN; Manufacture 1: Winbond; Component Group: Digital IC; PP Material Stack: 0; Part Number: W25Q64JVZEIQ; Footprint: WSON-8x6; Manufacture Part Number 1: W25Q64JVZEIQ; Pin Count: 9; Supplier 1: Digi-Key; Mounting Technology: SMT; RoHS: Yes; Component Kind: Standard; Component Type: Standard; PP Rotation: 0; PP Rotation1: 0
U19 = MT25QL256ABA1EW9-0SIT: IC FLASH 256M SPI 133MHZ 8WPDFN; Manufacture 1: Winbond; Component Group: Digital IC; PP Material Stack: 0; Part Number: W25Q256JVEIQ; Footprint: WSON-8x6; Manufacture Part Number 1: W25Q256JVEIQ; Pin Count: 9; Supplier 1: Digi-Key; Mounting Technology: SMT; RoHS: Yes; Component Kind: Standard; Component Type: Standard; PP Rotation: 0; PP Rotation1: 0
X2 = ABM10AIG-12.000MHZ-4Z-T3: 12MHz, SMD; Manufacture 1: Abracon LLC; Component Group: Crystal; PP Material Stack: 0; Part Number: ABM10AIG-12.000MHZ-4Z-T3; Manufacture Part Number 1: ABM10AIG-12.000MHZ-4Z-T3; Pin Count: 4; Supplier 1: Digi-Key; Supplier Part Number 1: 535-13360-1-ND; Value: 12.000MHz; Mounting Technology: SMT; Component Kind: Standard; Component Type: Standard; PP Rotation: 0

## Sheet sb-sonata-industriaal.SchDoc: RS485,RS232,Eth Connectors
size Letter; Organization: NewAE Technology Inc.; Address1: 1083 Queen St., Suite 196; Address2: Halifax; Address3: NS; Address4: Canada B3H 0B2; SheetNumber: 6; SheetTotal: 20; SheetApproved: NO
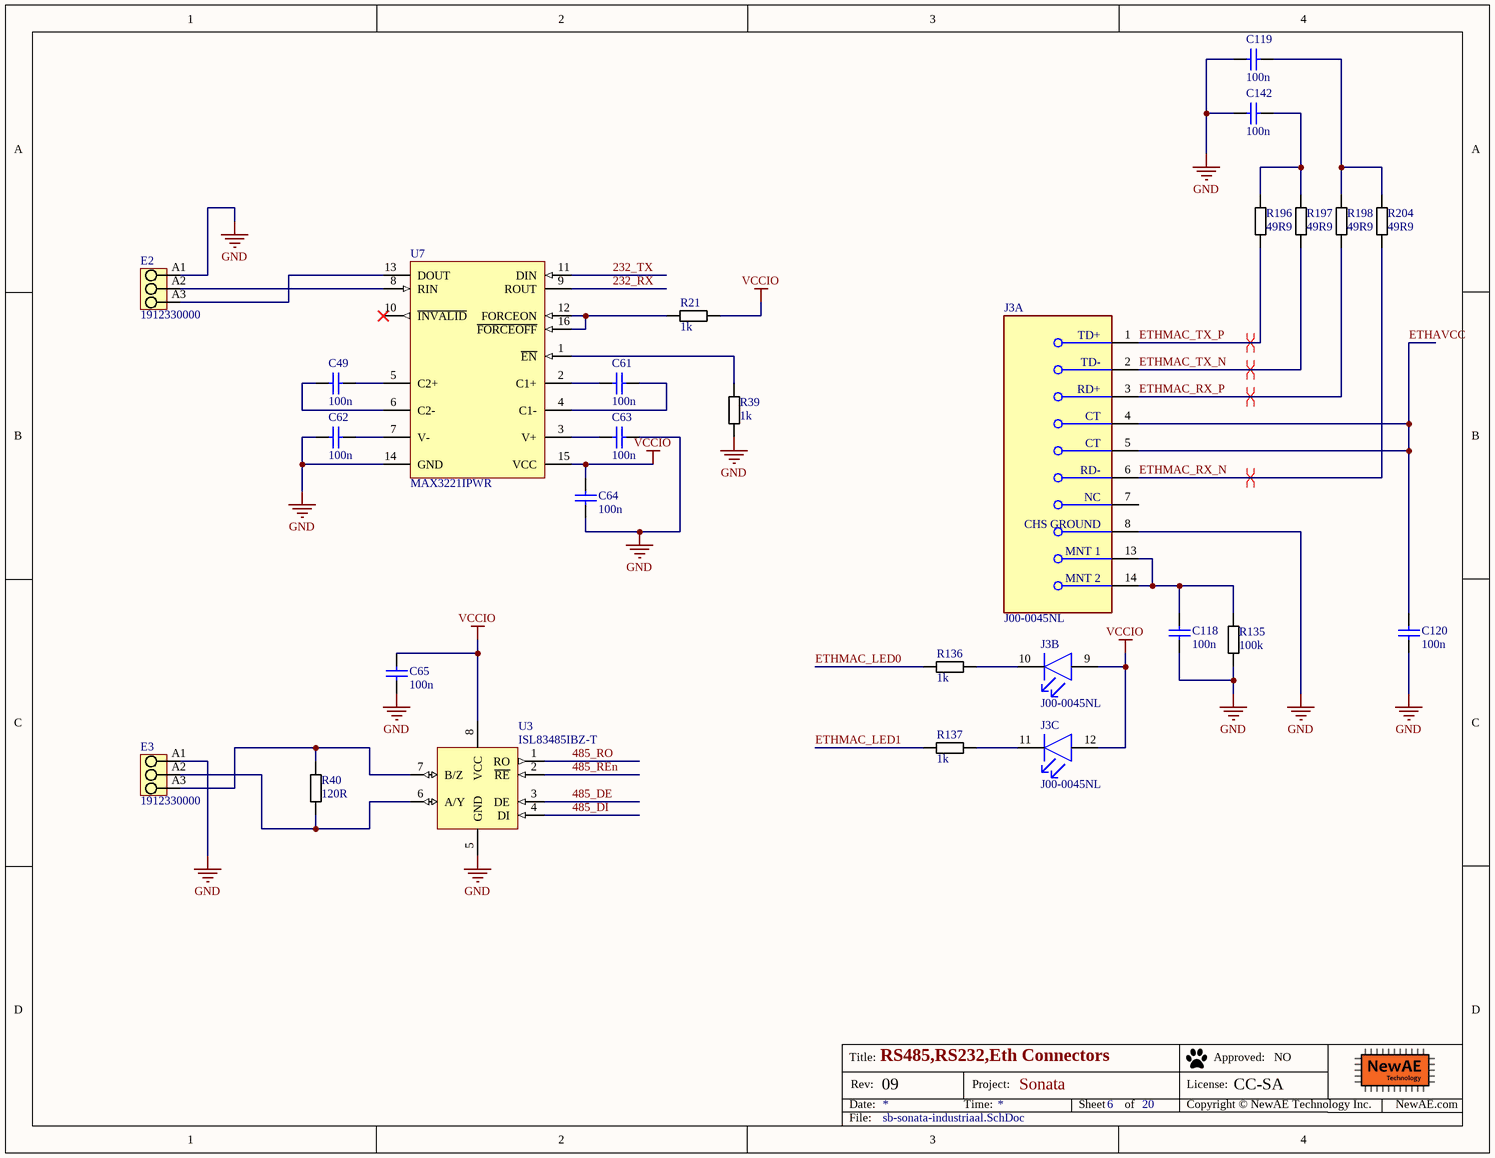
[diagram p5: sb-sonata-industriaal.SchDoc]

### Parts
C49  100n  [CAPC0402_M]
C61  100n  [CAPC0402_M]
C62  100n  [CAPC0402_M]
C63  100n  [CAPC0402_M]
C64  100n  [CAPC0402_M]
C65  100n  [CAPC0402_M]
C118  100n  [CAPC0402_M]
C119  100n  [CAPC0402_M]
C120  100n  [CAPC0402_M]
C142  100n  [CAPC0402_M]
E2  1912330000  [PS_3_5_90_03]
E3  1912330000  [PS_3_5_90_03]
J3  J00-0045NL  [FP-J00-0045NL-MFG]  (parts A,B,C of 3)
R21  1k  [RESC1608X55N]
R39  1k  [RESC1608X55N]
R40  120R  [RESC1608X55N]
R135  100k  [RESC1005X40N]
R136  1k  [RESC1608X55N]
R137  1k  [RESC1608X55N]
R196  49R9  [RESC2012X70N]
R197  49R9  [RESC2012X70N]
R198  49R9  [RESC2012X70N]
R204  49R9  [RESC2012X70N]
U3  ISL83485IBZ-T  [SOIC8_NARROW]
U7  MAX3221IPWR  [PW0016A_L]

### Nets
GND: C62.2 C63.1 C64.1 C65.2 C118.2 C119.1 C120.2 C142.1 E2.A1 E3.A1 J3.8(CHS_GROUND) R39.2 R135.2 U3.5(GND) U7.14(GND)
VCCIO: C64.2 C65.1 J3.9(GREEN_A) J3.12(YELLOW_ANODE) R21.2 U3.8(VCC) U7.15(VCC)  [project net 3V3_FTDI]
232_RX: U7.9(ROUT)
232_TX: U7.11(DIN)
485_DE: U3.3(DE)
485_DI: U3.4(DI)
485_REn: U3.2(~{RE})
485_RO: U3.1(RO)
ETHAVCC: C120.1 J3.4(CT) J3.5(CT)
ETHMAC_LED0: R136.1
ETHMAC_LED1: R137.1
ETHMAC_RX_N: J3.6(RD-) R204.2
ETHMAC_RX_P: J3.3(RD+) R198.2
ETHMAC_TX_N: J3.2(TD-) R197.2
ETHMAC_TX_P: J3.1(TD+) R196.2
NetC49_1: C49.1 U7.5(C2+)
NetC49_2: C49.2 U7.6(C2-)
NetC61_1: C61.1 U7.4(C1-)
NetC61_2: C61.2 U7.2(C1+)
NetC62_1: C62.1 U7.7(V-)
NetC63_2: C63.2 U7.3(V+)
NetC118_1: C118.1 J3.13(MNT_1) J3.14(MNT_2) R135.1
NetC119_2: C119.2 R198.1 R204.1
NetC142_2: C142.2 R196.1 R197.1
NetE2_A2: E2.A2 U7.8(RIN)
NetE2_A3: E2.A3 U7.13(DOUT)
NetE3_A2: E3.A2 R40.2 U3.6(A/Y)
NetE3_A3: E3.A3 R40.1 U3.7(B/Z)
NetJ3_10: J3.10(GREEN_C) R136.2
NetJ3_11: J3.11(YELLOW_CATHODE) R137.2
NetR21_1: R21.1 U7.12(FORCEON) U7.16(~{FORCEOFF})
NetR39_1: R39.1 U7.1(~{EN})

Not connected (* = marked no-connect by the designer): J3 7(NC); U7 10(~{INVALID})*

### Layout directives
differential pair; differential pair class ETHERNET: ETHMAC_RX_N, ETHMAC_RX_P, ETHMAC_TX_N, ETHMAC_TX_P

### Notes on the sheet
- Title:
- Date:
- Rev:
- Time:
- Project:
- Sheet
- of
- License:
- Copyright © NewAE Technology Inc.
- Approved:
- NewAE.com
- File:

### Library data of the parts
C49 C61-C65 C118-C120 C142 = CCHIP-100n-0402: as C4 on sheet sb-sonata-usb; Part Number: CCHIP-100n-0402; Footprint: 0402; Pin Count: 2; Supplier 1: Digi-Key; Supplier Part Number 1: 445-6901-1-ND; Value: 100n; Mounting Technology: SMT; Component Kind: Standard; Component Type: Standard
E2 E3 = CMP-1559-01636-1: OMNIMATE Signal - series PS; Manufacturer: Weidmueller; No_of_poles: 3; Side_termination_characteristic: closed side; Pitch_inch: 0,138 inch; Short_text_for_material: PS 3.50/03/90 3.5SN OR BX; Wire_cross_section_AWG_max_UL_1059: AWG 16; Rated_voltage_use_group_B_UL_1059: 300 V; Solid_min_H05_07_V_U: 0,2 mm²; Contact_surface: tinned; UL_94_flammability_rating: V-0; Pitch_mm: 3,5 mm; Contact_material: Cu-Leg; Rated_current_use_group_B_UL_1059: 10 A; Solid_max_H05_07_V_U: 1,5 mm²; Mounting_onto_the_PCB: Solder connection; Rated_voltage_for_surge_voltage_class_pollution_degree_II_2: 320 V; Insulating_material: Wemid (PA); Wire_cross_section_AWG_min_UL_1059: AWG 28; Revision: V1; ComponentLink2Description: URL Link1; Packaging: Box; Qty: 100 PCS; ComponentLink2URL: http://catalog.weidmueller.com/catalog/Start.do?localeId=en&ObjectID=1912330000; PackageReference: PS_3_5_90_03; ComponentLink1Description: Manufacturer URL; ComponentLink1URL: http://www.weidmueller.com/; Solder_pin_length_mm: 3,5 mm; PartNumber: 1912330000; Colour: Orange
J3 = CMP-16436-000005-1: CONN JACK 1PORT 100 BASE-TX PCB; Number of Cores per Jack: 4; Gender: Female; Connector Type: RJ45; Number of Positions Loaded: 8; Current Rating: 8mA; Pitch: 2.54mm; Shielding: Shielded; Direction: Down; Number of Ports: 1; Depth: 21.59mm; Radiation Hardening: No; Contact Material: Bronze; Contact Plating: Gold; Mount: Through Hole; Max Operating Temperature: 70°C; Packaging: Rail/Tube; Color: Green; Number of Contacts: 8; Lead Free: Lead Free; Series: STARJACK™ J00; Package Quantity: 30; Length: 16.26mm; Number of Rows: 1; Min Operating Temperature: 0°C; Termination: Solder; Orientation: Right Angle; Housing Material: Thermoplastic
R21 R39 R136 R137 = RCHIP-1K-0603: 1k res, 0603, 1%, 1/10W; Manufacture 1: Yageo; Manufacture Part Number 1: RC0603FR-071KL; Component Group: Resistor; Case-EIA: 0603; Case-Metric: 1608; Rated Power: 0.1W; Rated Voltage: 75VDC; Part Number: RCHIP-1K-0603; Footprint: 0603; Pin Count: 2; Supplier 1: Digi-Key; Supplier Part Number 1: 311-1.00KHRCT-ND; Value: 1k; Tolerance: 1%; Mounting Technology: SMT; Temperature Range: -55C to 155C; Component Kind: Standard; Component Type: Standard
R40 = RCHIP-120R-0603: 120R res, 0603, 1%, 1/10W; Manufacture 1: Yageo; Manufacture Part Number 1: RC0603FR-07120RL; Component Group: Resistor; Case-EIA: 0603; Case-Metric: 1608; Rated Power: 0.1W; Rated Voltage: 75VDC; Part Number: RCHIP-120R-0603; Footprint: 0603; Pin Count: 2; Supplier 1: Digi-Key; Supplier Part Number 1: 311-120HRCT-ND; Value: 120R; Tolerance: 1%; Mounting Technology: SMT; Temperature Range: -55C to 155C; Component Kind: Standard; Component Type: Standard
R135 = RCHIP-100K-0402: as R2 on sheet sb-sonata-usb; Part Number: RCHIP-100K-0402; Footprint: 0402; Pin Count: 2; Supplier 1: Digi-Key; Supplier Part Number 1: 311-100KLRCT-ND; Value: 100k; Tolerance: 1%; Mounting Technology: SMT; Temperature Range: -55C to 155C; Component Kind: Standard; Component Type: Standard
R196-R198 R204 = RCHIP-49R9-0805: 49r9 res, 0805, 1%, 1/8W; Manufacture 1: Yageo; Manufacture Part Number 1: RC0805FR-0749R9L; Component Group: Resistor; Case-EIA: 0805; Case-Metric: 2012; Rated Power: 0.125W; Rated Voltage: 75VDC; Part Number: RCHIP-49R9-0805; Footprint: 0805; Pin Count: 2; Supplier 1: Digi-Key; Supplier Part Number 1: 311-49.9CRCT-ND; Value: 49R9; Tolerance: 1%; Mounting Technology: SMT; RoHS: Yes; Temperature Range: -55C to 155C; Component Kind: Standard; Component Type: Standard
U3 = ISL83485I: IC TXRX RS422/RS485; Manufacture 1: Renesas; Component Group: Digital IC; Part Number: ISL83485I; Footprint: SOIC8; Manufacture Part Number 1: ISL83485IBZ-T; Pin Count: 8; Supplier 1: Digi-Key; Supplier Part Number 1: ISL83485IBZ-TCT-ND; Mounting Technology: SMT; RoHS: Yes; Component Kind: Standard; Component Type: Standard
U7 = CMP-0299-01761-2: 3-V to 5.5-V Single-Channel RS-232 Line Driver / Receiver with ±15-kV ESD Protection, -40 to 85 degC, 16-Pin TSSOP (PW), Green (RoHS & no Sb/Br); Drivers Per Package: 1; ESD HBM(kV): +/-15; Supply Voltage(s)(V): 3.3 or 5.0; RS-232: TRUE; ComponentLink2Description: Datasheet; ComponentLink3URL: http://www.ti.com/litv/pdf/mpds361; SubFamily: RS-232; PackageDescription: 16-Pin Plastic Thin Small Outline Package 5 x 4.4 mm Body ,0.65 mm Pitch; ICC(Max)(mA): 1; PackageReference: PW0016A; Receivers Per Package: 1; DatasheetVersion: SLLS348M; PackageVersion: revG, Feb-2011; ComponentLink1URL: www.ti.com; ComponentLink1Description: Manufacturer URL; ComponentLink2URL: http://www.ti.com/general/docs/lit/getliterature.tsp?genericPartNumber=MAX3221&fileType=pdf; ComponentLink3Description: Package Specification; Single Supply: TRUE